# Altium schematic sheet TXPA.SchDoc: Transmitter PA #1
size Legal; CheckedBy: J. Brinton; CompanyName: Signal Laboratories, Inc.; DrawnBy: J. Brinton; Engineer: J. Brinton; Address1: 3479 Edison Way; Address2: Menlo Park CA 94025; Address3: +1 (877) 778-8435; Address4: siglabs.com; DocumentNumber: 56; Revision: 2b; SheetNumber: 57; SheetTotal: 58
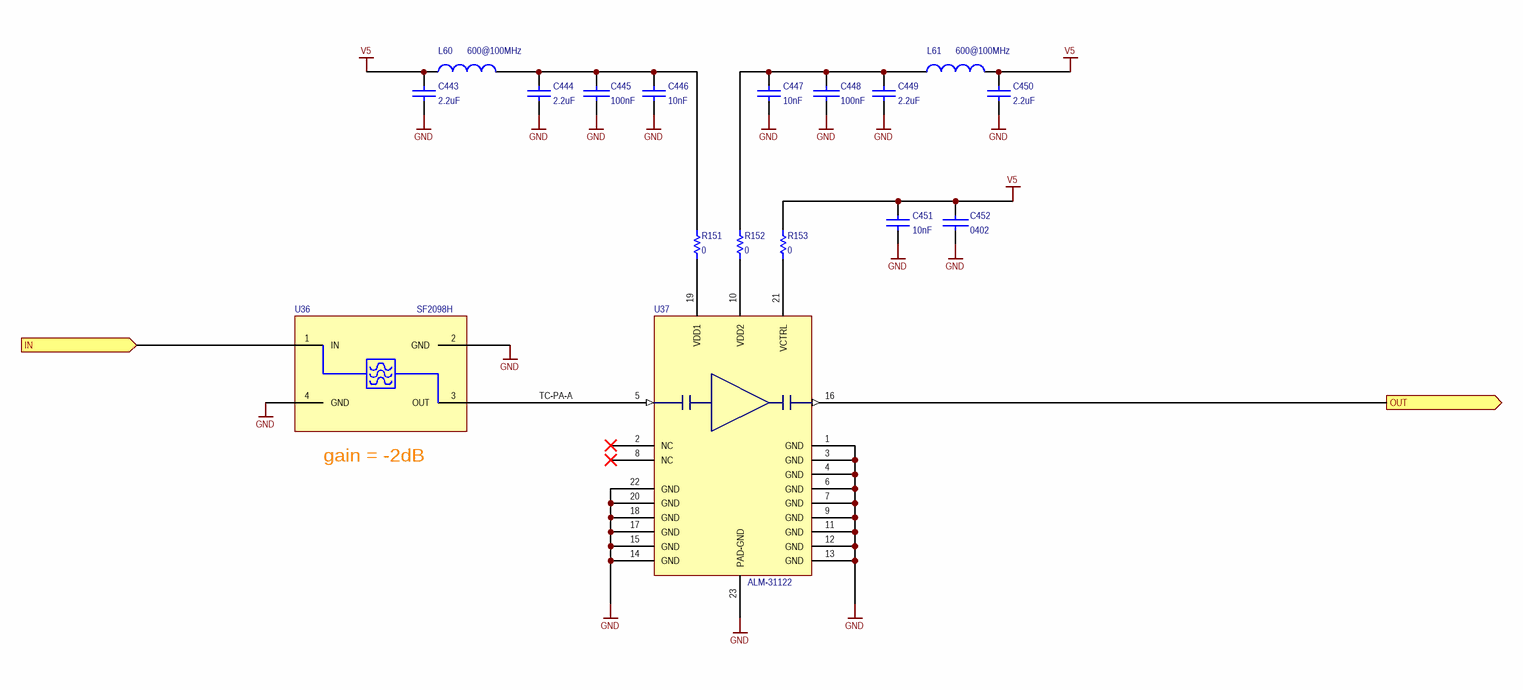
[diagram p0: TXPA.SchDoc]

## Parts
C443  value 2.2uF  [0805]  (hidden comment: GRM21BR71C225KA12L)
C444  value 2.2uF  [0805]  (hidden comment: GRM21BR71C225KA12L)
C445  value 100nF  [0402]  (hidden comment: GRM155R71C104KA88J)
C446  value 10nF  [0402]  (hidden comment: GRM155R71E103KA01D)
C447  value 10nF  [0402]  (hidden comment: GRM155R71E103KA01D)
C448  value 100nF  [0402]  (hidden comment: GRM155R71C104KA88J)
C449  value 2.2uF  [0805]  (hidden comment: GRM21BR71C225KA12L)
C450  value 2.2uF  [0805]  (hidden comment: GRM21BR71C225KA12L)
C451  value 10nF  [0402]  (hidden comment: GRM155R71E103KA01D)
C452  GRM155R71C104KA88J  [0402]  (value not drawn)
L60  value 600@100MHz  [0402]  (hidden comment: BLM15PX601SN1D)
L61  value 600@100MHz  [0402]  (hidden comment: BLM15PX601SN1D)
R151  value 0  [0603]  (hidden comment: ERJ-3GEY0R00V)
R152  value 0  [0603]  (hidden comment: ERJ-3GEY0R00V)
R153  value 0  [0603]  (hidden comment: ERJ-3GEY0R00V)
U36  SF2098H  [SM2016-4]
U37  ALM-31122  [ALM-31122]

## Ports
IN (in), OUT (out)

## Nets
GND: C443.1 C444.1 C445.1 C446.1 C447.1 C448.1 C449.1 C450.1 C451.1 C452.1 U36.2(GND) U36.4(GND) U37.1(GND) U37.3(GND) U37.4(GND) U37.6(GND) U37.7(GND) U37.9(GND) U37.11(GND) U37.12(GND) U37.13(GND) U37.14(GND) U37.15(GND) U37.17(GND) U37.18(GND) U37.20(GND) U37.22(GND) U37.23(PAD-GND)
V5: C443.2 C450.2 C451.2 C452.2 L60.2 L61.1 R153.2
IN: U36.1(IN) ; port IN
OUT: U37.16(RFOUT) ; port OUT
TC-PA-A: U36.3(OUT) U37.5(RFIN)
NetC444_2: C444.2 C445.2 C446.2 L60.1 R151.2
NetC447_2: C447.2 C448.2 C449.2 L61.2 R152.2
NetR151_1: R151.1 U37.19(VDD1)
NetR152_1: R152.1 U37.10(VDD2)
NetR153_1: R153.1 U37.21(VCTRL)

Not connected (* = marked no-connect by the designer): U37 2(NC)* 8(NC)*

## Notes on the sheet
- (near U36) gain = -2dB
- Title
- Engineer
- Revision
- Drawn By
- Checked By
- Date
- Sheet
- of

## Library data of the parts
C443 C444 C449 C450 = CAP 0805: Ceramic Capacitor 2.2uF ±10% 10V X7R 0805; Manufacturer: Murata; Tr: -55:125; Voltage: 10V; Manufacturer P/N: GRM21BR71C225KA12L; Package: 0805; Do Not Place: *; Tolerance: ±10%
C445 C448 C452 = CAP: Ceramic Capacitor 100nF ±10% 16V X7R 0402; Manufacturer: Murata; Tr: -55:125; Manufacturer P/N: GRM155R71C104KA88J; Voltage: 16V; Package: 0402; Tolerance: ±10%
  C452: Value: 100nF
C446 C447 C451 = CAP 0402: Ceramic Capacitor 10nF ±10% 25V X7R 0402; Manufacturer: Murata; Tr: -55:125; Voltage: 25V; Manufacturer P/N: GRM155R71E103KA01D; Package: 0402; Tolerance: ±10%
L60 L61 = IND 0402: Ferrite Bead 600-Ohm @ 100MHz 900mA 0402; Manufacturer: Murata; Tolerance: ±25%; Tr: -55:125; Manufacturer P/N: BLM15PX601SN1D; Package: 0402
R151-R153 = RES 0603: Thick Film Resistor Jumper 0603; Manufacturer: Panasonic; Tr: -55:155; Package: 0603; Manufacturer P/N: ERJ-3GEY0R00V; Do Not Place: *; Tolerance: 0
U36 = SF2098H: 915 MHz SAW Filter; Manufacturer: RFM; Manufacturer P/N: SF2098H
U37 = ALM-31122: 1-watt High-Linearity Power Amplifier; Manufacturer: Avago; Manufacturer P/N: ALM-31122